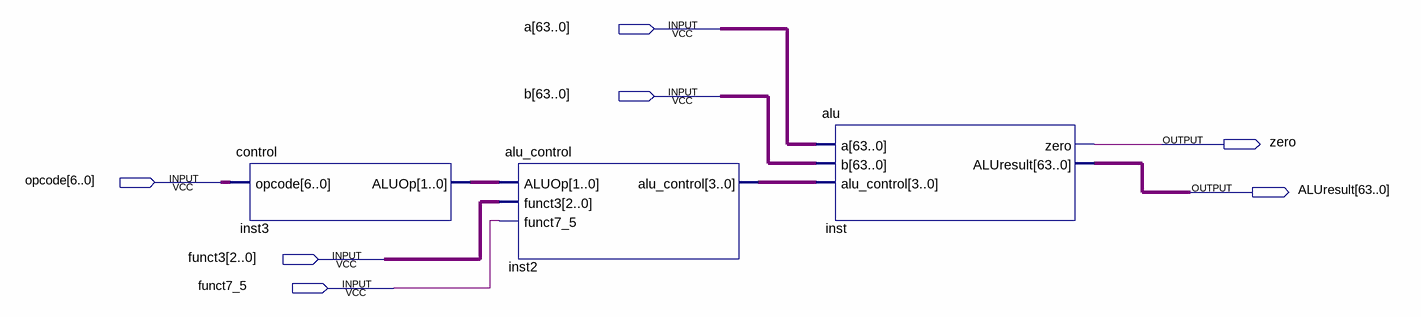
[diagram p0: schematic sheet]
// Quartus schematic aluCore.bdf as structural Verilog: 3 symbols, 7 pins
module aluCore (
  input  [63:0] a,
  input  [63:0] b,
  input  [6:0] opcode,
  input  [2:0] funct3,
  input  funct7_5,
  output zero,
  output [63:0] ALUresult
);

  wire [1:0] inst3_aluop;
  wire [3:0] inst2_alu_control;

  control inst3 (.opcode(opcode), .ALUOp(inst3_aluop));
  alu_control inst2 (.ALUOp(inst3_aluop), .funct3(funct3), .funct7_5(funct7_5), .alu_control(inst2_alu_control));
  alu inst (.a(a), .b(b), .alu_control(inst2_alu_control), .zero(zero), .ALUresult(ALUresult));
endmodule
